# Altium schematic sheet 00 BLOCK DIAGRAM.SchDoc
size A3
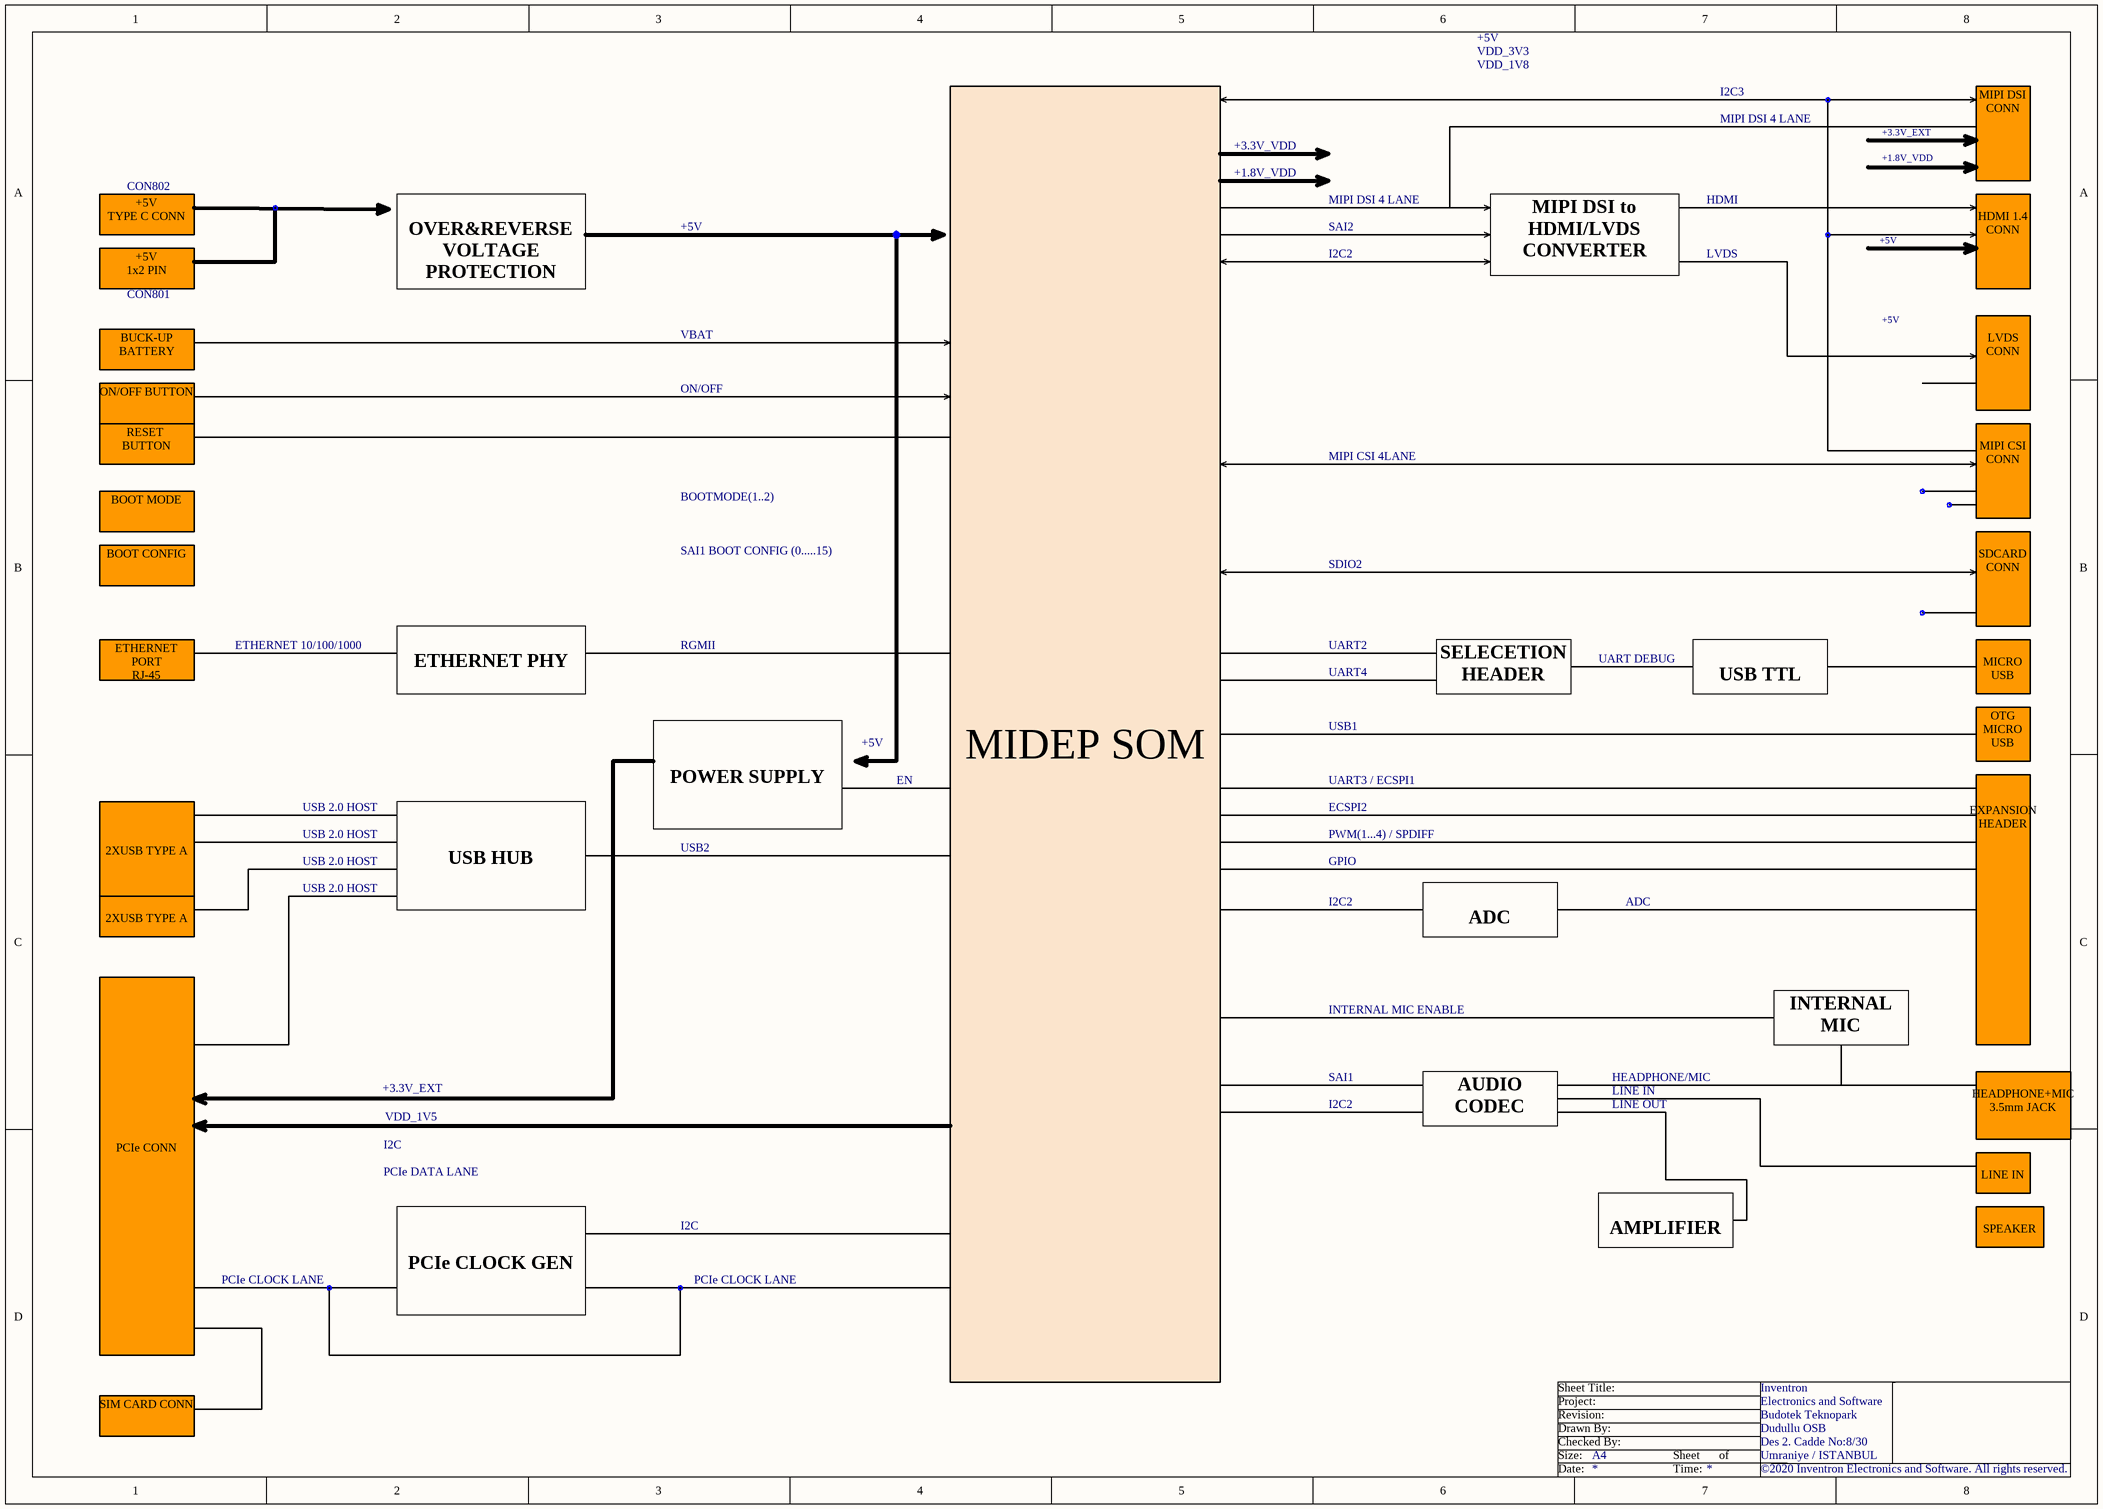
[diagram p0: 00 BLOCK DIAGRAM.SchDoc]

## Notes on the sheet
- +5V
- VDD_3V3
- VDD_1V8
- I2C3
- +3.3V_VDD
- +1.8V_VDD
- MIPI DSI 4 LANE
- +3.3V_EXT
- MIPI DSI CONN
- +5V
  TYPE C CONN
- CON802
- SAI2
- HDMI
- +5V
  1x2 PIN
- CON801
- OVER&REVERSE VOLTAGE
  PROTECTION
- I2C2
- MIPI DSI to HDMI/LVDS CONVERTER
- LVDS
- HDMI 1.4 CONN
- BUCK-UP BATTERY
- VBAT
- ON/OFF BUTTON
- ON/OFF
- LVDS CONN
- RESET
  BUTTON
- BOOTMODE(1..2)
- MIPI CSI 4LANE
- MIPI CSI CONN
- BOOT MODE
- BOOT CONFIG
- SAI1 BOOT CONFIG (0.....15)
- SDIO2
- ETHERNET 10/100/1000
- RGMII
- UART2
- SDCARD CONN
- ETHERNET PORT
  RJ-45
- ETHERNET PHY
- UART4
- SELECETION HEADER
- UART DEBUG
- USB TTL
- MICRO USB
- EN
- UART3 / ECSPI1
- USB1
- OTG
  MICRO USB
- USB 2.0 HOST
- POWER SUPPLY
- USB2
- ECSPI2
- PWM(1...4) / SPDIFF
- 2XUSB TYPE A
- USB HUB
- GPIO
- ADC
- INTERNAL MIC ENABLE
- INTERNAL MIC
- EXPANSION HEADER
- VDD_1V5
- SAI1
- AUDIO CODEC
- HEADPHONE/MIC
- LINE IN
- LINE OUT
- I2C
- PCIe DATA LANE
- HEADPHONE+MIC
  3.5mm JACK
- AMPLIFIER
- SPEAKER
- PCIe CLOCK LANE
- PCIe CLOCK GEN
- PCIe CONN
- MIDEP SOM
- SIM CARD CONN
- Sheet Title:
- Inventron
- Size:
- Drawn By:
- Revision:
- Project:
- Checked By:
- A4
- Sheet
- of
- Budotek Teknopark
- Dudullu OSB
- Des 2. Cadde No:8/30
- Umraniye / ISTANBUL
- Electronics and Software
- Date:
- Time:
- ©2020 Inventron Electronics and Software. All rights reserved.